# Altium schematic sheet ADC.SchDoc
size A4; SheetNumber: 1; SheetTotal: 3
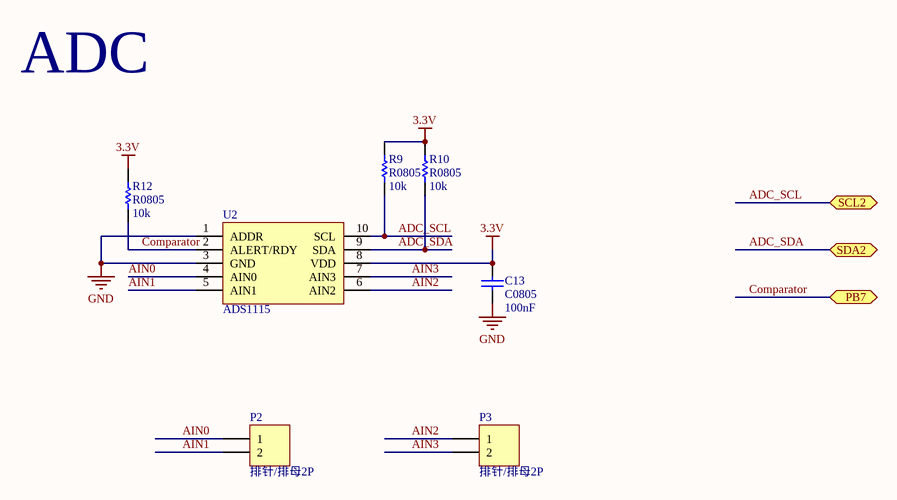
[diagram p0: ADC.SchDoc]

## Parts
C13  Case/Package: C0805  [C0805_200X125X140L50N]  (hidden comment: 100nF)
P2  排针/排母2P  [HDR1X2]
P3  排针/排母2P  [HDR1X2]
R9  Case/Package: R0805  [R0805_200X125X140L50N]  (hidden comment: 10k)
R10  Case/Package: R0805  [R0805_200X125X140L50N]  (hidden comment: 10k)
R12  Case/Package: R0805  [R0805_200X125X140L50N]  (hidden comment: 10k)
U2  ADS1115  [VSSOP-10_L3.0-W3.0-P0.50-LS4.9-BL]

## Ports
PB7 (bidir), SCL2 (bidir), SDA2 (bidir)

## Nets
3.3V: C13.2 R9.2 R10.2 R12.2 U2.8(VDD)
GND: C13.1 U2.1(ADDR) U2.3(GND)
ADC_SCL: R9.1 U2.10(SCL) ; port SCL2
ADC_SDA: R10.1 U2.9(SDA) ; port SDA2
AIN0: P2.1 U2.4(AIN0)
AIN1: P2.2 U2.5(AIN1)
AIN2: P3.1 U2.6(AIN2)
AIN3: P3.2 U2.7(AIN3)
Comparator: R12.1 U2.2(ALERT/RDY) ; port PB7

## Notes on the sheet
- ADC

## Library data of the parts
C13 = Cap0805: 0805 SMT MLCC Capacitor; Voltage: 50V; Tolerance: 10%; ProductIndex: 11; Published: 8-Jun-2000; LatestRevisionDate: 17-Jul-2002; LatestRevisionNote: Re-released for DXP Platform.; PackageReference: RAD-0.3; Publisher: Altium Limited; PackageDescription: Radial Cap, Thru-Hole; 2 Leads; 0.3 in Pin Spacing; Voltage Rating: 50V; ProductType: Capacitors; Value: 100nF
P2 P3 = Header 2: Header, 2-Pin; LatestRevisionDate: 17-Jul-2002; LatestRevisionNote: Re-released for DXP Platform.; Publisher: Altium Limited
R9 R10 R12 = Res0805: 0805 SMT Resistor; Tolerance: 1%; ProductIndex: 10; Published: 8-Jun-2000; LatestRevisionDate: 17-Jul-2002; LatestRevisionNote: Re-released for DXP Platform.; PackageReference: AXIAL-0.3; Publisher: Altium Limited; PackageDescription: Axial Device, Thru-Hole; 2 Leads; 0.3 in Pin Spacing; ProductType: Resistors; Value: 10k
U2 = ADS1115: ADS111x Ultra-Small, Low-Power, I / 2C-Compatible, 860-SPS, 16-Bit ADCs / With Internal Reference, Oscillator, and Programmable Comparator; Manufacturer: TI; ProductIndex: 0; ProductType: Integrated Circuits; Case/Package: SOP10; ComponentLink1Description: Datasheet; ComponentLink1URL: https://www.ti.com/lit/ds/symlink/ads1115.pdf; Value: ADS1115